# Altium schematic sheet Motor Unit Output.SchDoc
size A
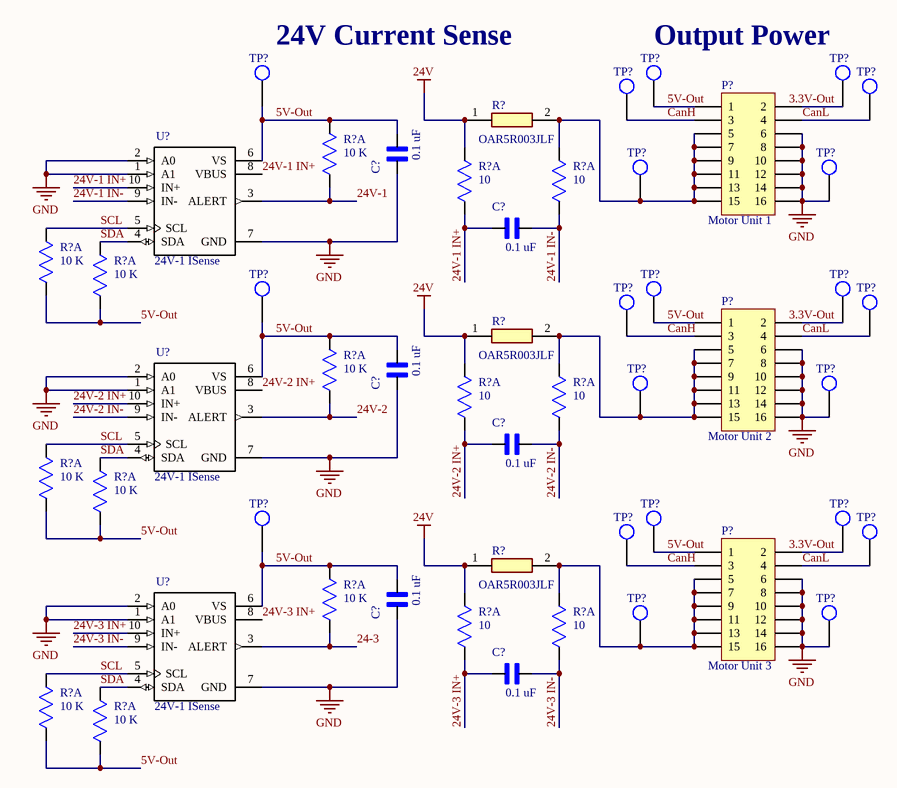
[diagram p0: Motor Unit Output.SchDoc]

## Parts
(Parts that share a designator on the sheet are numbered #1, #2 ... from top to bottom, then left to right.)
C?#1  0.1 uF  [*CAPC2012X135N]
C?#2  0.1 uF  [*CAPC2012X135N]
C?#3  0.1 uF  [*CAPC2012X135N]
C?#4  0.1 uF  [*CAPC2012X135N]
C?#5  0.1 uF  [*CAPC2012X135N]
C?#6  0.1 uF  [*CAPC2012X135N]
P?#1  Motor Unit 1  [HDR2X8]
P?#2  Motor Unit 2  [HDR2X8]
P?#3  Motor Unit 3  [HDR2X8]
R?#1  OAR5R003JLF  [OAR5R003JLF]
R?#2  10 K  [RC0805N]  (part A of 2)
R?#3  10  [RC0805N]  (part A of 2)
R?#4  10  [RC0805N]  (part A of 2)
R?#5  10 K  [RC0805N]  (part A of 2)
R?#6  10 K  [RC0805N]  (part A of 2)
R?#7  OAR5R003JLF  [OAR5R003JLF]
R?#8  10 K  [RC0805N]  (part A of 2)
R?#9  10  [RC0805N]  (part A of 2)
R?#10  10  [RC0805N]  (part A of 2)
R?#11  10 K  [RC0805N]  (part A of 2)
R?#12  10 K  [RC0805N]  (part A of 2)
R?#13  OAR5R003JLF  [OAR5R003JLF]
R?#14  10 K  [RC0805N]  (part A of 2)
R?#15  10  [RC0805N]  (part A of 2)
R?#16  10  [RC0805N]  (part A of 2)
R?#17  10 K  [RC0805N]  (part A of 2)
R?#18  10 K  [RC0805N]  (part A of 2)
TP?#1  Test Point  [Test Point Through-hole]  (value not drawn)
TP?#2  Test Point  [Test Point Through-hole]  (value not drawn)
TP?#3  Test Point  [Test Point Through-hole]  (value not drawn)
TP?#4  Test Point  [Test Point Through-hole]  (value not drawn)
TP?#5  Test Point  [Test Point Through-hole]  (value not drawn)
TP?#6  Test Point  [Test Point Through-hole]  (value not drawn)
TP?#7  Test Point  [Test Point Through-hole]  (value not drawn)
TP?#8  Test Point  [Test Point Through-hole]  (value not drawn)
TP?#9  Test Point  [Test Point Through-hole]  (value not drawn)
TP?#10  Test Point  [Test Point Through-hole]  (value not drawn)
TP?#11  Test Point  [Test Point Through-hole]  (value not drawn)
TP?#12  Test Point  [Test Point Through-hole]  (value not drawn)
TP?#13  Test Point  [Test Point Through-hole]  (value not drawn)
TP?#14  Test Point  [Test Point Through-hole]  (value not drawn)
TP?#15  Test Point  [Test Point Through-hole]  (value not drawn)
TP?#16  Test Point  [Test Point Through-hole]  (value not drawn)
TP?#17  Test Point  [Test Point Through-hole]  (value not drawn)
TP?#18  Test Point  [Test Point Through-hole]  (value not drawn)
TP?#19  Test Point  [Test Point Through-hole]  (value not drawn)
TP?#20  Test Point  [Test Point Through-hole]  (value not drawn)
TP?#21  Test Point  [Test Point Through-hole]  (value not drawn)
U?#1  24V-1 ISense  [*SOP50P490X110-10N]
U?#2  24V-1 ISense  [*SOP50P490X110-10N]
U?#3  24V-1 ISense  [*SOP50P490X110-10N]

## Nets
24V: R?#1.1 R?#3.1 R?#7.1 R?#9.1 R?#13.1 R?#15.1
GND: C?#1.1 C?#3.1 C?#5.1 P?#1.6 P?#1.8 P?#1.10 P?#1.12 P?#1.14 P?#1.16 P?#2.6 P?#2.8 P?#2.10 P?#2.12 P?#2.14 P?#2.16 P?#3.6 P?#3.8 P?#3.10 P?#3.12 P?#3.14 P?#3.16 TP?#7.1 TP?#14.1 TP?#21.1 U?#1.1(A1) U?#1.2(A0) U?#1.7(GND) U?#2.1(A1) U?#2.2(A0) U?#2.7(GND) U?#3.1(A1) U?#3.2(A0) U?#3.7(GND)
5V-Out: C?#1.2 C?#3.2 C?#5.2 P?#1.1 P?#2.1 P?#3.1 R?#2.1 R?#8.1 R?#14.1 TP?#1.1 TP?#2.1 TP?#8.1 TP?#9.1 TP?#15.1 TP?#16.1 U?#1.6(VS) U?#2.6(VS) U?#3.6(VS)
24-3: U?#3.3(ALERT)
24V-1: U?#1.3(ALERT)
24V-1 IN+: C?#2.1 U?#1.8(VBUS) U?#1.10(IN+)
24V-1 IN-: C?#2.2 U?#1.9(IN-)
24V-2: U?#2.3(ALERT)
24V-2 IN+: C?#4.1 U?#2.8(VBUS) U?#2.10(IN+)
24V-2 IN-: C?#4.2 U?#2.9(IN-)
24V-3 IN+: C?#6.1 U?#3.8(VBUS) U?#3.10(IN+)
24V-3 IN-: C?#6.2 U?#3.9(IN-)
CanH: P?#1.3 P?#2.3 P?#3.3 TP?#4.1 TP?#11.1 TP?#18.1
CanL: P?#1.4 P?#2.4 P?#3.4 TP?#5.1 TP?#12.1 TP?#19.1
SCL: R?#5.1 R?#11.1 R?#17.1 U?#1.5(SCL) U?#2.5(SCL) U?#3.5(SCL)
SDA: R?#6.1 R?#12.1 R?#18.1 U?#1.4(SDA) U?#2.4(SDA) U?#3.4(SDA)
NetP?#1_2: P?#1.2 TP?#3.1
NetP?#1_5: P?#1.5 P?#1.7 P?#1.9 P?#1.11 P?#1.13 P?#1.15 R?#1.2 R?#4.1 TP?#6.1
NetP?#2_2: P?#2.2 TP?#10.1
NetP?#2_5: P?#2.5 P?#2.7 P?#2.9 P?#2.11 P?#2.13 P?#2.15 R?#7.2 R?#10.1 TP?#13.1
NetP?#3_2: P?#3.2 TP?#17.1
NetP?#3_5: P?#3.5 P?#3.7 P?#3.9 P?#3.11 P?#3.13 P?#3.15 R?#13.2 R?#16.1 TP?#20.1

Not connected (* = marked no-connect by the designer): R?#2 2; R?#3 2; R?#4 2; R?#5 2; R?#6 2; R?#8 2; R?#9 2; R?#10 2; R?#11 2; R?#12 2; R?#14 2; R?#15 2; R?#16 2; R?#17 2; R?#18 2

## Notes on the sheet
- (near TP?#1) 24V Current Sense
- (near TP?#2) Output Power
- Labels drawn without touching a wire or pin: 3.3V-Out

## Library data of the parts
C?#1-C?#6 = EMK212BJ225KG-T: / Cap Ceramic 2.2uF 16V X5R 10% SMD 0805 125Â°C Embossed T/R /; MF: Taiyo Yuden; MP: EMK212BJ225KG-T; Package: 2012 Taiyo Yuden; Digi-Key_Purchase_URL: https://www.digikey.com/product-detail/en/taiyo-yuden/EMK212BJ225KG-T/587-1293-1-ND/931070?utm_source=snapeda&utm_medium=aggregator&utm_campaign=symbol; Digi-Key_Part_Number: 587-1293-1-ND; SnapEDA_Link: https://www.snapeda.com/parts/EMK212BJ225KG-T/Taiyo%20Yuden/view-part/?ref=snap; Value: *
P?#1-P?#3 = Header 8X2: Header, 8-Pin, Dual row; LatestRevisionDate: 17-Jul-2002; LatestRevisionNote: Re-released for DXP Platform.; Publisher: Altium Limited
R?#1 R?#7 R?#13 = OAR5R003JLF: Resistor; Manufacturer_Name: WELWYN; Datasheet Link: https://componentsearchengine.com/Datasheets/1/OAR5R003JLF.pdf; Height: 22.4mm; Manufacturer_Part_Number: OAR5R003JLF; Mouser Part Number: 66-OAR5R003JLF; Mouser Price/Stock: https://www.mouser.com/Search/Refine.aspx?Keyword=66-OAR5R003JLF
R?#2-R?#6 R?#8-R?#12 R?#14-R?#18 = CRCW0805681RFKEA: No Description Available; Manufacturer_Part_Number: CRCW0805681RFKEA_1; Vendor: Vishay; Built_By: EMA_UL_Team; Copyright: Copyright (C) 2018 Accelerated Designs. All rights reserved; RefDes: RefDes; Type: DEV; Value: Value
U?#1-U?#3 = INA226AIDGSR: Current Monitor Regulator High/Low-Side 10mA 10-VSSOP; MF: Texas Instruments; Digi-Key_Part_Number: 296-29034-1-ND; SnapEDA_Link: https://www.snapeda.com/parts/INA226AIDGSR/Texas%20Instruments/view-part/53552/?ref=snap; Package: MSOP-10 Texas Instruments; MP: INA226AIDGSR; Digi-Key_Purchase_URL: https://www.digikey.com/product-detail/en/texas-instruments/INA226AIDGSR/296-29034-1-ND/2687118?utm_source=snapeda&utm_medium=aggregator&utm_campaign=symbol; Value: *